# EAGLE design eater_eeprom (EAGLE 9.6.2)
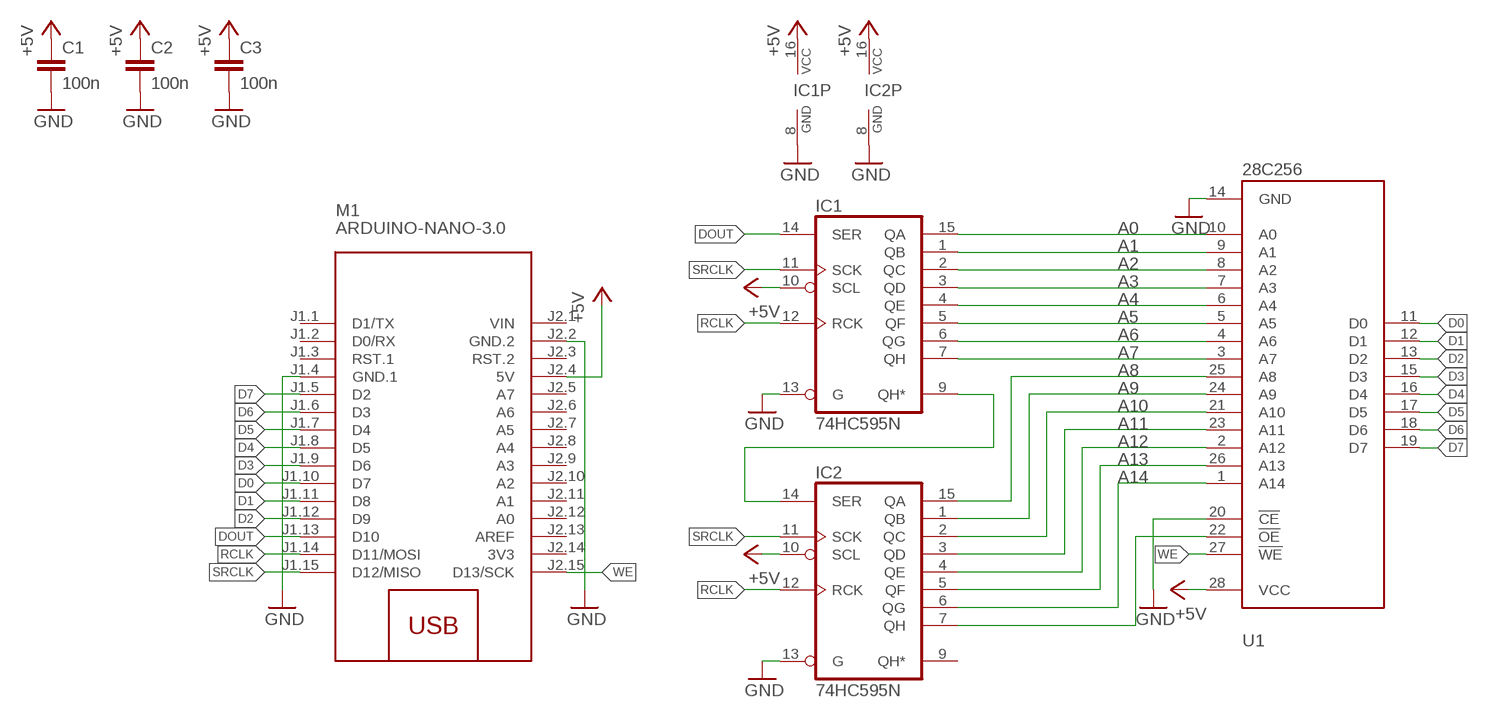
[diagram p0: schematic, sheet 1]

## Parts
C1  100n  C-EUC0805  [C0805]
C2  100n  C-EUC0805  [C0805]
C3  100n  C-EUC0805  [C0805]
IC1  74HC595N  [DIL16]
IC2  74HC595N  [DIL16]
M1  ARDUINO-NANO-3.0  [ARDUINO-NANO-3.0]
U1  28C256  [DIL28-6]

## Nets
+5V: C1.1 C2.1 C3.1 IC1.10(SCL) IC1.16(VCC) IC2.10(SCL) IC2.16(VCC) M1.J2.4(5V) U1.28(VCC)
A0: IC1.15(QA) U1.10(A0)
A1: IC1.1(QB) U1.9(A1)
A2: IC1.2(QC) U1.8(A2)
A3: IC1.3(QD) U1.7(A3)
A4: IC1.4(QE) U1.6(A4)
A5: IC1.5(QF) U1.5(A5)
A6: IC1.6(QG) U1.4(A6)
A7: IC1.7(QH) U1.3(A7)
A8: IC2.15(QA) U1.25(A8)
A9: IC2.1(QB) U1.24(A9)
A10: IC2.2(QC) U1.21(A10)
A11: IC2.3(QD) U1.23(A11)
A12: IC2.4(QE) U1.2(A12)
A13: IC2.5(QF) U1.26(A13)
A14: IC2.6(QG) U1.1(A14)
D0: M1.J1.10(D7) U1.11(D0)
D1: M1.J1.11(D8) U1.12(D1)
D2: M1.J1.12(D9) U1.13(D2)
D3: M1.J1.9(D6) U1.15(D3)
D4: M1.J1.8(D5) U1.16(D4)
D5: M1.J1.7(D4) U1.17(D5)
D6: M1.J1.6(D3) U1.18(D6)
D7: M1.J1.5(D2) U1.19(D7)
DOUT: IC1.14(SER) M1.J1.13(D10)
GND: C1.2 C2.2 C3.2 IC1.8(GND) IC1.13(G) IC2.8(GND) IC2.13(G) M1.J1.4(GND.1) M1.J2.2(GND.2) U1.14(GND) U1.20(!CE)
N$1: IC1.9(QH*) IC2.14(SER)
N$18: IC2.7(QH) U1.22(!OE)
RCLK: IC1.12(RCK) IC2.12(RCK) M1.J1.14(D11/MOSI)
SRCLK: IC1.11(SCK) IC2.11(SCK) M1.J1.15(D12/MISO)
WE: M1.J2.15(D13/SCK) U1.27(!WE)
Unconnected: IC2.9(QH*) M1.J1.1(D1/TX) M1.J1.2(D0/RX) M1.J1.3(RST.1) M1.J2.3(RST.2) M1.J2.5(A7) M1.J2.6(A6) M1.J2.7(A5) M1.J2.8(A4) M1.J2.9(A3) M1.J2.10(A2) M1.J2.11(A1) M1.J2.12(A0) M1.J2.13(AREF)

## Power pins joined to a net without a drawn wire
3V3: M1.J2.14(3V3)
VIN: M1.J2.1(VIN)

## Library data of the parts
C1-C3 = rcl:C-EU: CAPACITOR, European symbol; SPICEPREFIX: C
IC1 IC2 = 74xx-eu:74*595: 8-bit SHIFT REGISTER, output latch
M1 = diy-modules:ARDUINO-NANO-3.0: Arduino Nano 3.0 and compatible devices More details available here: https://www.arduino.cc/en/Main/ArduinoBoardNano Click here to find device on ebay.com <http://www.ebay.com/sch/arduino+nano>
U1 = 6502_lib:28C256

## Board
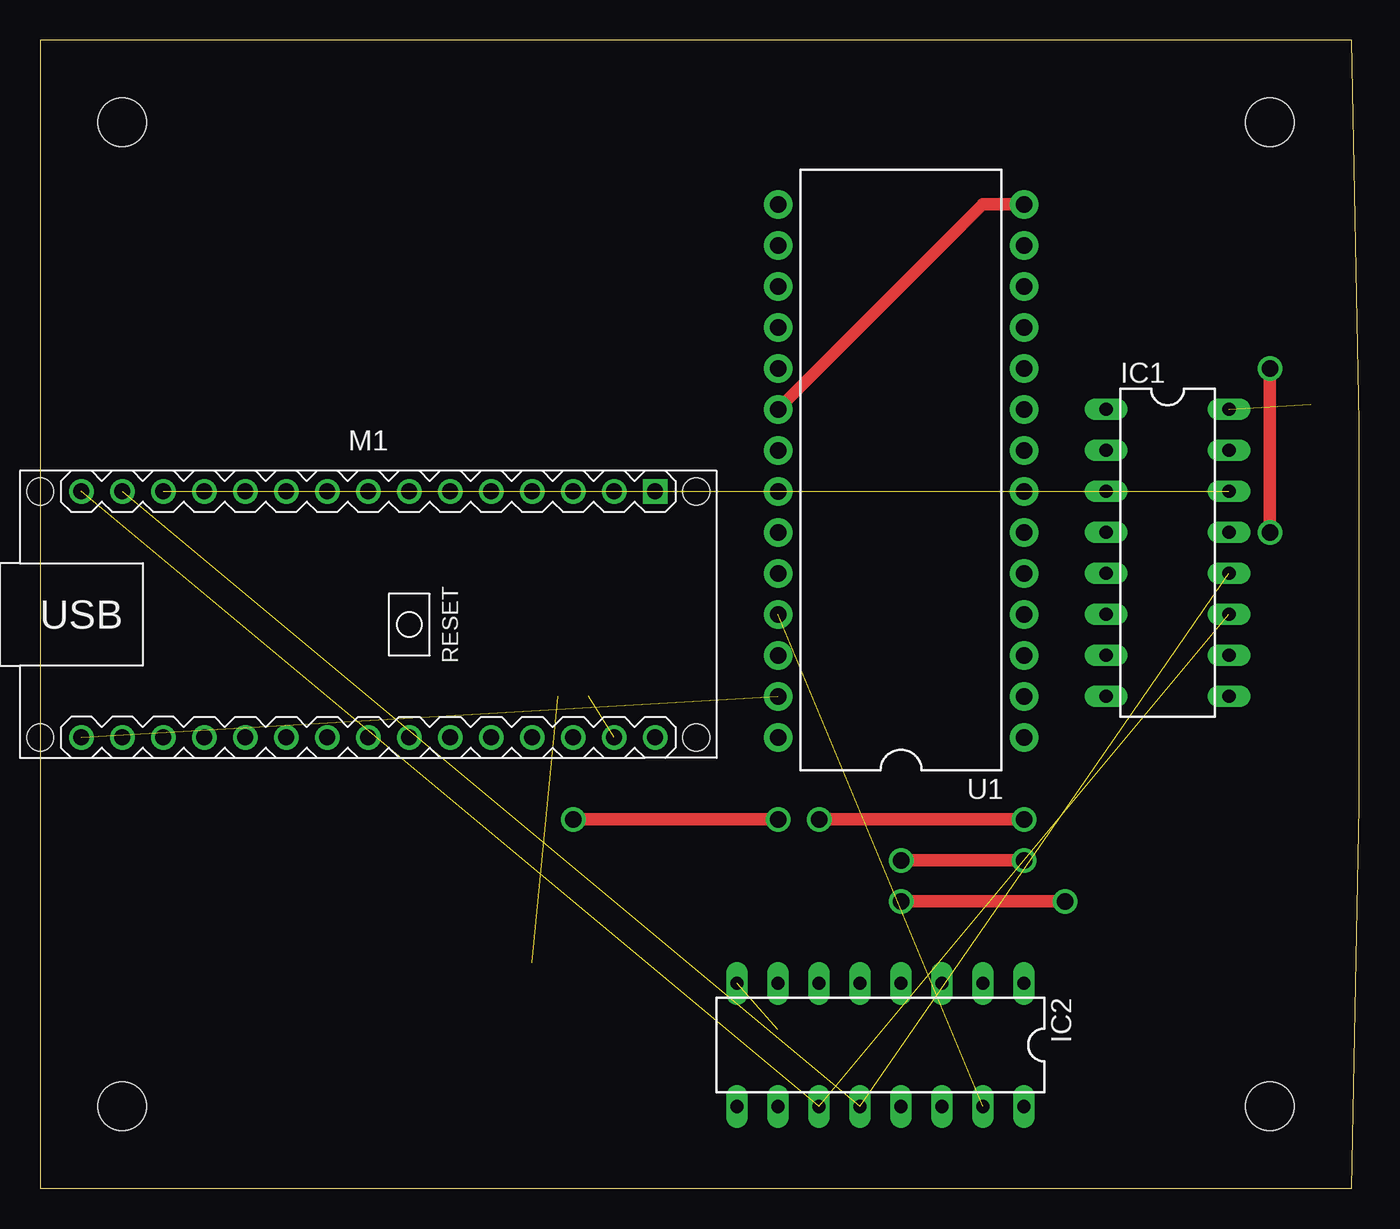
[diagram p1: board, top side]
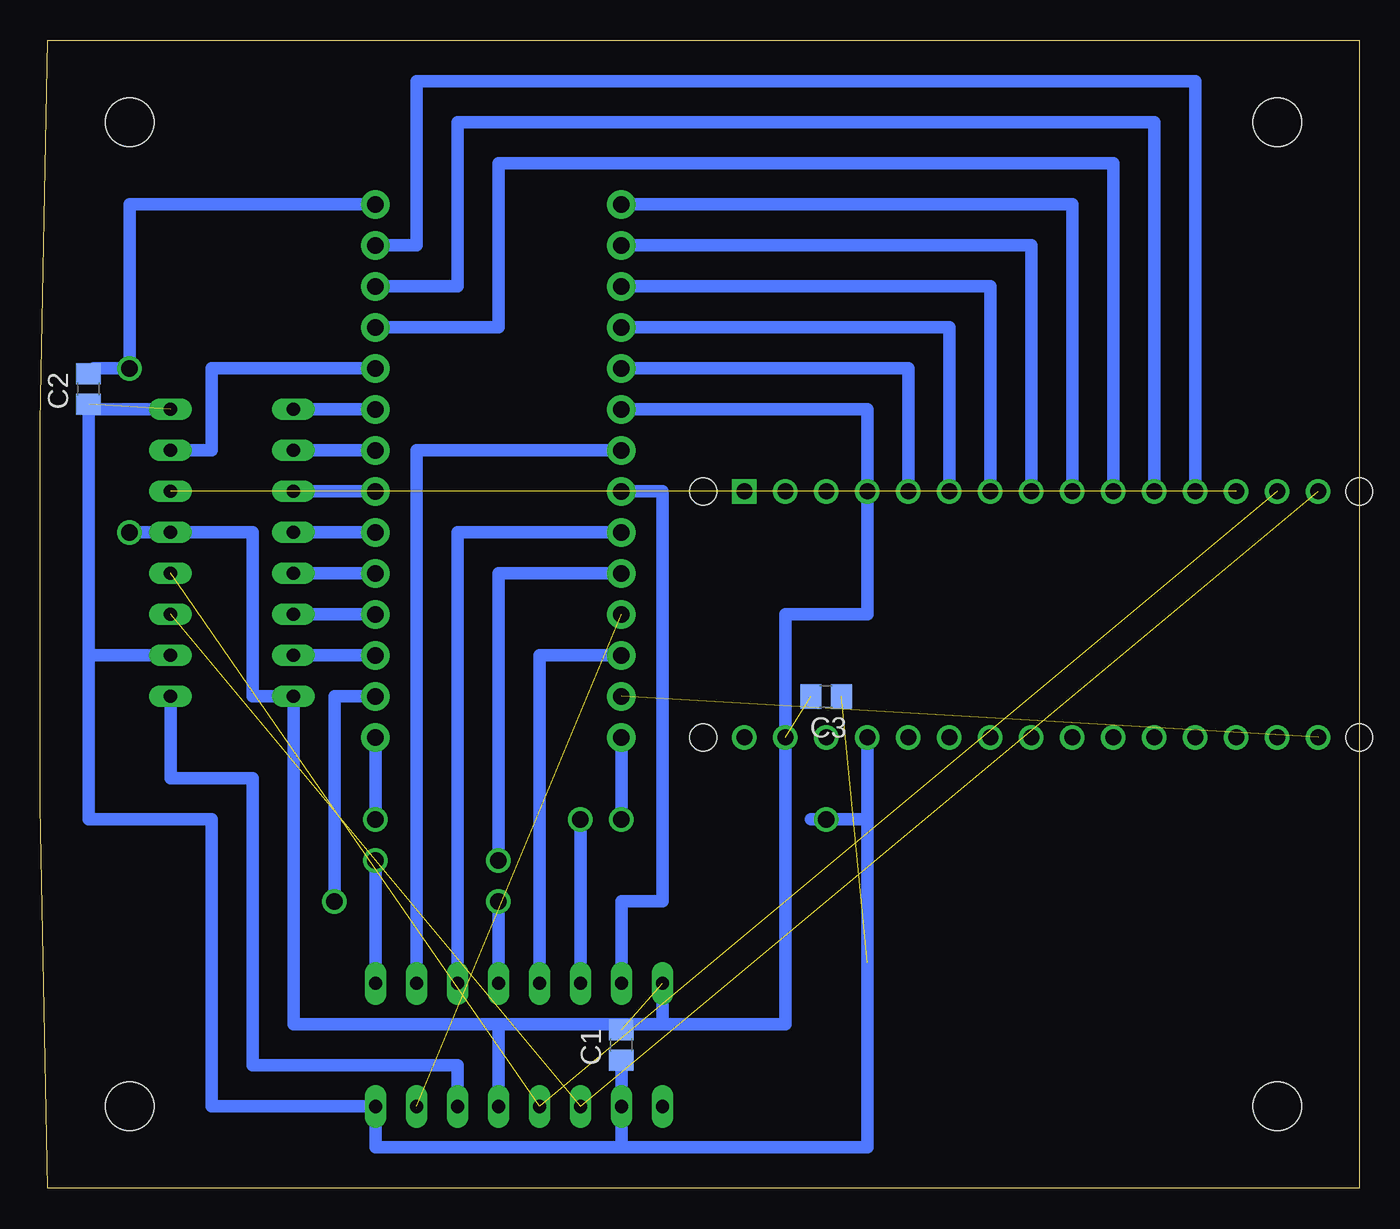
[diagram p2: board, bottom side, seen from below]

Size 81.72 x 71.12 mm. Coordinates in mm from the lower left corner, seen from the top.
Outline: 0,0 81.28,0 arc3 81.28,71.12 0,71.12 0,0
Copper layers (1*16): Top 0.035mm / dielectric 1.5mm / Bottom 0.035mm
Design rules "default": minimum track width 6mil, minimum drill 0.35mm, track to track 6mil, track to pad 6mil, pad to pad 6mil, via to via 6mil, smd to smd 6mil, copper to edge 40mil, drill to drill 6mil, minimum pad ring 10mil, minimum via ring 8mil, stop-mask expansion 4mil, vias tented up to drill 0mil, thermal gap 10mil
Holes 3 mm at 5.08,66.04 76.2,66.04 76.2,5.08 5.08,5.08

### Footprints (pad centres in the part's own frame; a part is rotated, then mirrored left to right if it is on the bottom)
C0805 = smd 1.3 x 1.5: 1 -0.95,0; 2 0.95,0
DIL16 = drill 0.813 long: 1 -8.89,-3.81; 2 -6.35,-3.81; 3 -3.81,-3.81; 4 -1.27,-3.81; 5 1.27,-3.81; 6 3.81,-3.81; 7 6.35,-3.81; 8 8.89,-3.81; 9 8.89,3.81; 10 6.35,3.81; 11 3.81,3.81; 12 1.27,3.81; 13 -1.27,3.81; 14 -3.81,3.81; 15 -6.35,3.81; 16 -8.89,3.81
ARDUINO-NANO-3.0 = drill 1 square: J1.1 17.78,7.62 | drill 1: J1.2 15.24,7.62; J1.3 12.7,7.62; J1.4 10.16,7.62; J1.5 7.62,7.62; J1.6 5.08,7.62; J1.7 2.54,7.62; J1.8 0,7.62; J1.9 -2.54,7.62; J1.10 -5.08,7.62; J1.11 -7.62,7.62; J1.12 -10.16,7.62; J1.13 -12.7,7.62; J1.14 -15.24,7.62; J1.15 -17.78,7.62; J2.1 17.78,-7.62; J2.2 15.24,-7.62; J2.3 12.7,-7.62; J2.4 10.16,-7.62; J2.5 7.62,-7.62; J2.6 5.08,-7.62; J2.7 2.54,-7.62; J2.8 0,-7.62; J2.9 -2.54,-7.62; J2.10 -5.08,-7.62; J2.11 -7.62,-7.62; J2.12 -10.16,-7.62; J2.13 -12.7,-7.62; J2.14 -15.24,-7.62; J2.15 -17.78,-7.62 | hole 1.651: -20.32,7.62; -20.32,-7.62; 20.32,-7.62; 20.32,7.62
DIL28-6 = drill 1.016 pad 1.778: 1 -16.51,-7.62; 2 -13.97,-7.62; 3 -11.43,-7.62; 4 -8.89,-7.62; 5 -6.35,-7.62; 6 -3.81,-7.62; 7 -1.27,-7.62; 8 1.27,-7.62; 9 3.81,-7.62; 10 6.35,-7.62; 11 8.89,-7.62; 12 11.43,-7.62; 13 13.97,-7.62; 14 16.51,-7.62; 15 16.51,7.62; 16 13.97,7.62; 17 11.43,7.62; 18 8.89,7.62; 19 6.35,7.62; 20 3.81,7.62; 21 1.27,7.62; 22 -1.27,7.62; 23 -3.81,7.62; 24 -6.35,7.62; 25 -8.89,7.62; 26 -11.43,7.62; 27 -13.97,7.62; 28 -16.51,7.62

### Placement (x,y rotation side)
C1  45.72,8.89 90 bottom
C2  78.74,49.53 90 bottom
C3  33.02,30.48 180 bottom
IC1  69.85,39.37 270 top
IC2  52.07,8.89 180 top
M1  20.32,35.56 0 top
U1  53.34,44.45 90 top

### Tracks (layer width: path | path; a pad name or v marks a point on that pad's centre or on a via)
+5V  (via drill 1.02)  (2 unrouted)
  Top 0.762: v45.72,22.86 v33.02,22.86
  Bottom 0.762: IC1.16 78.74,48.26 78.74,33.02 | 78.74,33.02 IC1.10 | U1.28 v45.72,22.86 | 78.74,33.02 78.74,22.86 71.12,22.86 71.12,5.08 IC2.16 60.96,2.54 45.72,2.54 | 45.72,2.54 IC2.10 C1.1 | 45.72,2.54 30.48,2.54 30.48,13.97 30.48,22.86 | 30.48,22.86 M1.J2.4 | 33.97,22.86 v33.02,22.86 30.48,22.86
A0
  Bottom 0.762: U1.10 71.12,50.8 71.12,45.72 IC1.15
A1
  Bottom 0.762: U1.9 IC1.1
A2
  Bottom 0.762: U1.8 IC1.2
A3
  Bottom 0.762: U1.7 IC1.3
A4
  Bottom 0.762: U1.6 IC1.4
A5
  Bottom 0.762: U1.5 IC1.5
A6
  Bottom 0.762: U1.4 IC1.6
A7
  Bottom 0.762: U1.3 IC1.7
A8  (1 unrouted)
A9  (via drill 1.02)
  Top 0.762: v53.34,20.32 v60.96,20.32
  Bottom 0.762: U1.24 53.34,38.1 v53.34,20.32 | v60.96,20.32 IC2.1
A10
  Bottom 0.762: U1.21 58.42,45.72 IC2.2
A11
  Bottom 0.762: U1.23 55.88,40.64 IC2.3
A12  (via drill 1.02)
  Top 0.762: v63.5,17.78 v53.34,17.78
  Bottom 0.762: U1.2 63.5,30.48 v63.5,17.78 | v53.34,17.78 IC2.4
A13
  Bottom 0.762: U1.26 50.8,33.02 IC2.5
A14  (via drill 1.02)
  Top 0.762: v48.26,22.86 v60.96,22.86
  Bottom 0.762: IC2.6 v48.26,22.86 | v60.96,22.86 U1.1
D0
  Bottom 0.762: U1.11 53.34,53.34 53.34,63.5 15.24,63.5 M1.J1.10
D1
  Bottom 0.762: U1.12 55.88,55.88 55.88,66.04 12.7,66.04 M1.J1.11
D2
  Bottom 0.762: U1.13 58.42,58.42 58.42,68.58 10.16,68.58 M1.J1.12
D3
  Bottom 0.762: U1.15 17.78,60.96 M1.J1.9
D4
  Bottom 0.762: M1.J1.8 20.32,58.42 U1.16
D5
  Bottom 0.762: U1.17 22.86,55.88 M1.J1.7
D6
  Bottom 0.762: M1.J1.6 25.4,53.34 U1.18
D7
  Bottom 0.762: U1.19 27.94,50.8 M1.J1.5
DOUT  (1 unrouted)
GND  (via drill 1.02)  (2 unrouted)
  Top 0.762: U1.20 58.42,60.96 U1.14 | v76.2,50.8 v76.2,40.64
  Bottom 0.762: U1.20 30.48,48.26 M1.J1.4 30.48,35.56 35.56,35.56 M1.J2.2 35.56,10.16 43.18,10.16 | U1.14 76.2,60.96 v76.2,50.8 78.42,50.8 C2.2 | v76.2,40.64 IC1.13 68.58,40.64 68.58,30.48 IC1.8 66.04,10.16 53.34,10.16 | 53.34,10.16 IC2.13 | 53.34,10.16 43.18,10.16 | 43.18,10.16 IC2.8
N$1
  Bottom 0.762: IC2.14 55.88,7.62 68.58,7.62 68.58,25.4 73.66,25.4 IC1.9
N$18
  Bottom 0.762: U1.22 43.18,43.18 43.18,17.78 45.72,17.78 IC2.7
RCLK  (2 unrouted)
SRCLK  (2 unrouted)
WE  (1 unrouted)